# EAGLE design Triple_axis_digital_-_output_gyro_ITG-3200_Breakout (EAGLE 6.4)
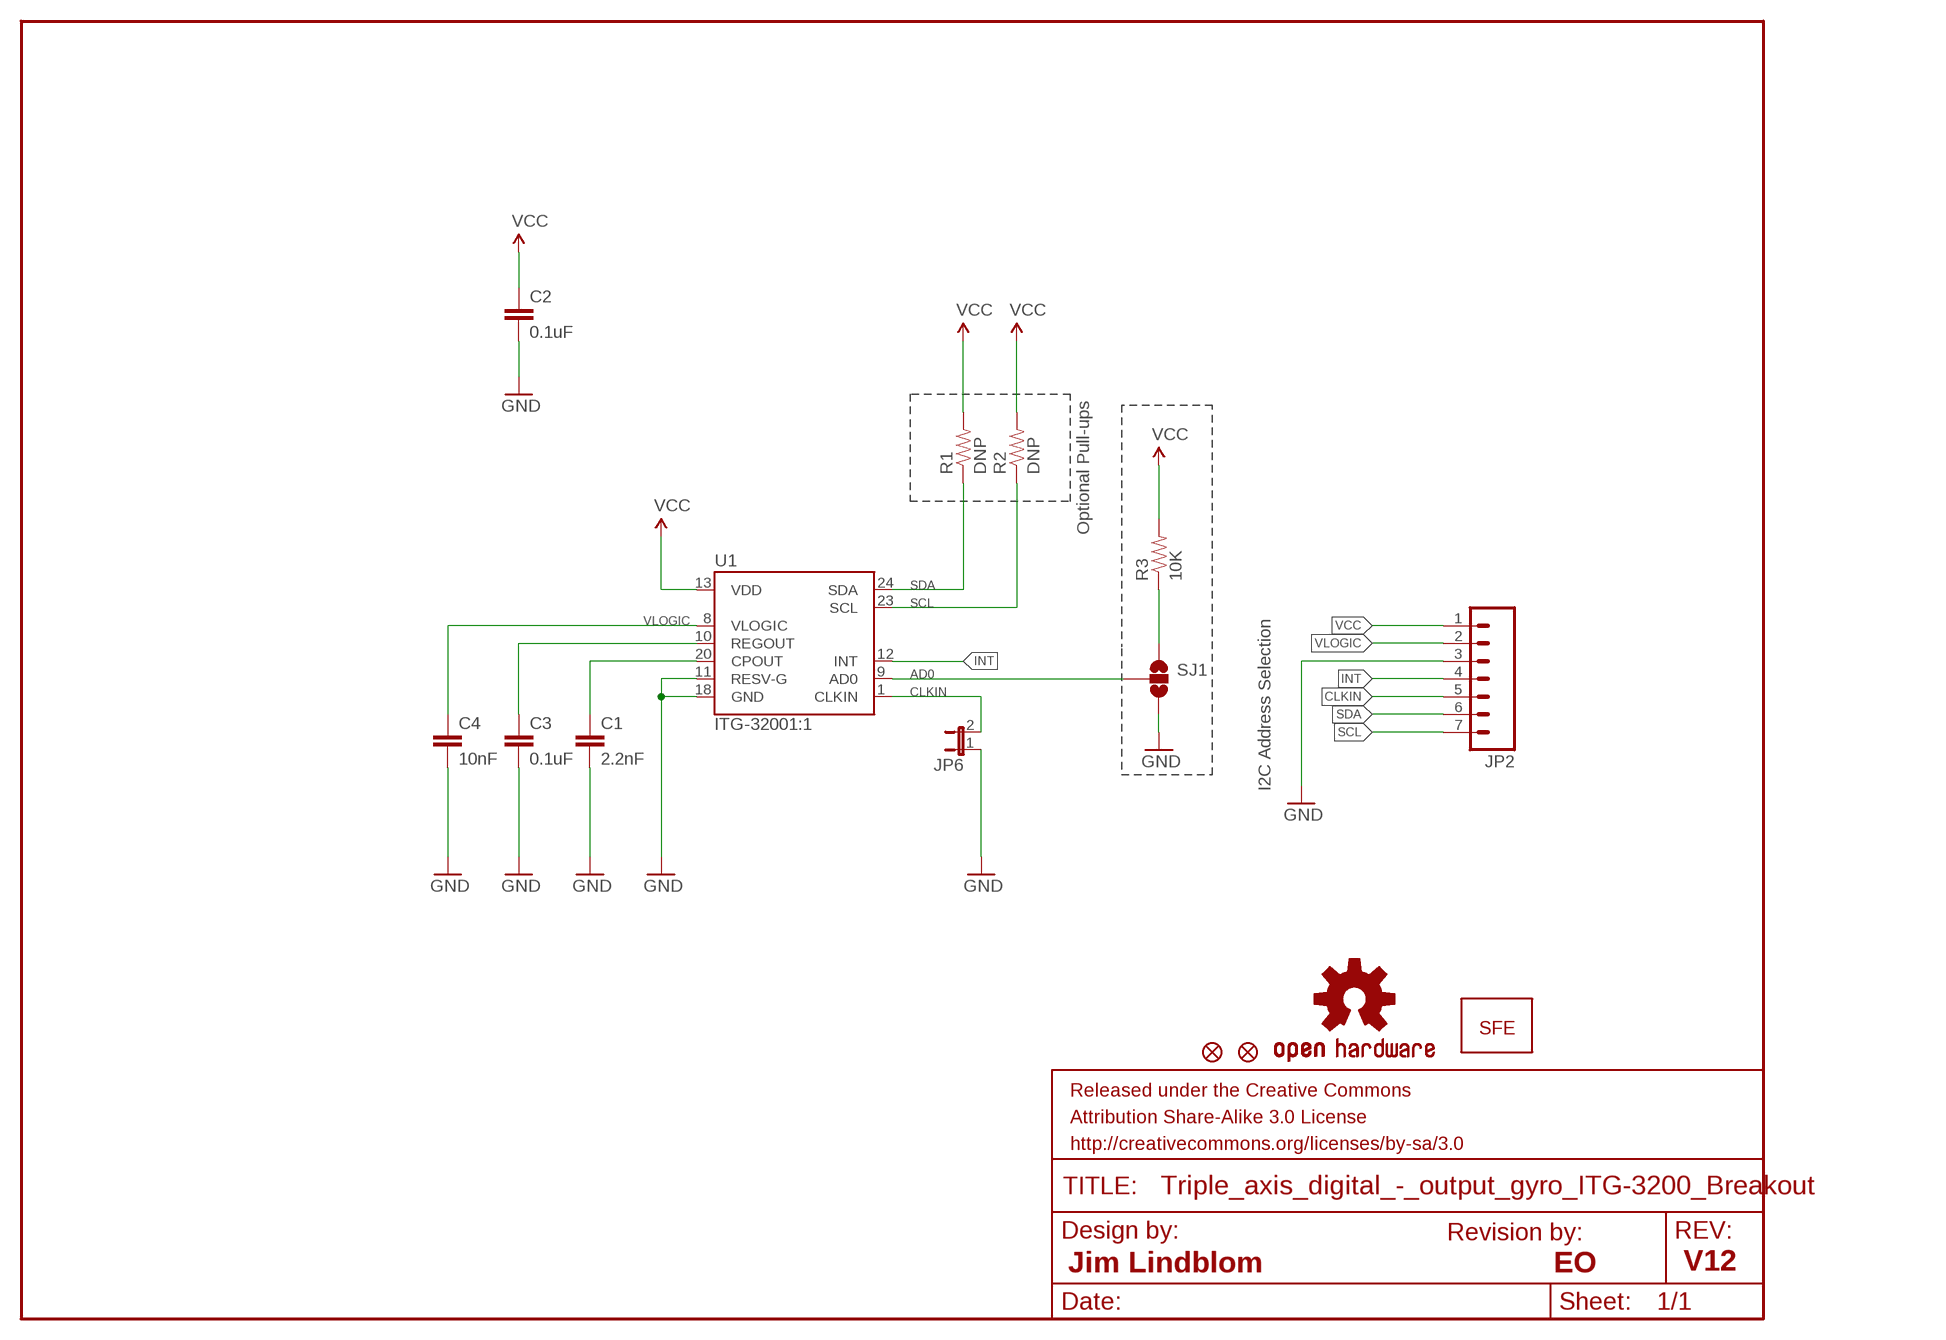
[diagram p0: schematic, sheet 1]

## Parts
C1  2.2nF  CAP0603-CAP  [0603-CAP]
C2  0.1uF  CAP0603-CAP  [0603-CAP]
C3  0.1uF  CAP0603-CAP  [0603-CAP]
C4  10nF  CAP0603-CAP  [0603-CAP]
FID1  FIDUCIALUFIDUCIAL  [MICRO-FIDUCIAL]
FID2  FIDUCIALUFIDUCIAL  [MICRO-FIDUCIAL]
FRAME1  FRAME-LETTER  [CREATIVE_COMMONS]
JP2  M07  [1X07]
JP6  JUMPER-2SMD-NO  [SJ_2S-NO]
LOGO1  OSHW-LOGOS  [OSHW-LOGO-S]
LOGO2  LOGO-SFESK  [SFE-LOGO-FLAME]
R1  DNP  RESISTOR0603-RES  [0603-RES]
R2  DNP  RESISTOR0603-RES  [0603-RES]
R3  10K  10KOHM1/10W1%(0603)0603  [0603-RES]
SJ1  SOLDERJUMPER_2WAYPASTE1&2  [SJ_3_PASTE1&2]
U1  ITG-32001:1  [QFN-24_ITG3200_1:1]

## Nets
AD0: SJ1.2 U1.9(AD0)
CLKIN: JP2.5 JP6.2 U1.1(CLKIN)
GND: C1.2 C2.2 C3.2 C4.2 JP2.3 JP6.1 SJ1.3 U1.11(RESV-G) U1.18(GND)
INT: JP2.4 U1.12(INT)
N$1: C1.1 U1.20(CPOUT)
N$2: C3.1 U1.10(REGOUT)
N$3: R3.1 SJ1.1
SCL: JP2.7 R2.1 U1.23(SCL)
SDA: JP2.6 R1.1 U1.24(SDA)
VCC: C2.1 JP2.1 R1.2 R2.2 R3.2 U1.13(VDD)
VLOGIC: C4.1 JP2.2 U1.8(VLOGIC)

## Notes on the sheet
- Optional Pull-ups
- I2C Address Selection
- Revision by:
- Jim Lindblom | EO | V12

## Library data of the parts
C1-C4 = SparkFun:CAP: Capacitor Standard 0603 ceramic capacitor, and 0.1" leaded capacitor.
FID1 FID2 = SparkFun-Aesthetics:FIDUCIAL: Fiducial Alignment Points Various fiducial points for machine vision alignment.
FRAME1 = SparkFun-Aesthetics:FRAME-LETTER: Schematic Frame Standard 8.5x11 US Letter frame
JP2 = SparkFun:M07: Header 7 Standard 7-pin 0.1" header. Use with straight break away headers (SKU : PRT-00116), right angle break away headers (PRT-00553), swiss pins (PRT-00743), machine pins (PRT-00117), and female headers (PRT-00115). NOTES ON THE VARIANTS LOCK and LOCK_LONGPADS... This footprint was designed to help hold the alignment of a through-hole component (i.e. 7-pin header) while soldering it into place. You may notice that each hole has been shifted either up or down by 0.005 of an inch from it's more standard position (which is usually a perfectly straight line). This slight alteration caused the pins (the squares in the middle) to touch the edges of the holes. Because they are alternating, it causes a "brace" to hold the header in place. 0.005 has proven to be the perfect amount of "off-center" position when using our standard breakaway headers. Although looks a little odd when you look at the bare footprint, once you have a header in there, the alteration is very hard to notice. Also, if you push a header all the way into place, it is covered up entirely on the bottom side. This idea of altering the position of holes to aid alignment will be further integrated into the Sparkfun Library for other footprints. It can help hold any component with 3 or more connection pins.
JP6 = SparkFun:JUMPER-2: Jumper Basic 0.1" spaced jumper. Use with breakaway headers.
LOGO1 = SparkFun-Aesthetics:OSHW-LOGO: Open Source Hardware Logo This logo indicates the piece of hardware it is found on incorporates a OSHW license and/or adheres to the definition of open source hardware found here: http://freedomdefined.org/OSHW
LOGO2 = SparkFun-Aesthetics:LOGO-SFE: Spark Fun Electronics PCB Logo This is the standard Spark Fun Electronics PCB logo.
R1 R2 = SparkFun:RESISTOR: Resistor Basic schematic elements and footprints for 0603, 1206, and PTH resistors.
R3 = SparkFun-Resistors:10KOHM1/10W1%(0603): RES-00824; PROD_ID: RES-00824
SJ1 = SparkFun:SOLDERJUMPER_2WAY: Solder Jumper 2 way solder jumper
U1 = SparkFun-DigitalIC:ITG-3200: ITG-3200 3-axis gyro, digital output, qfn24 package

## Board
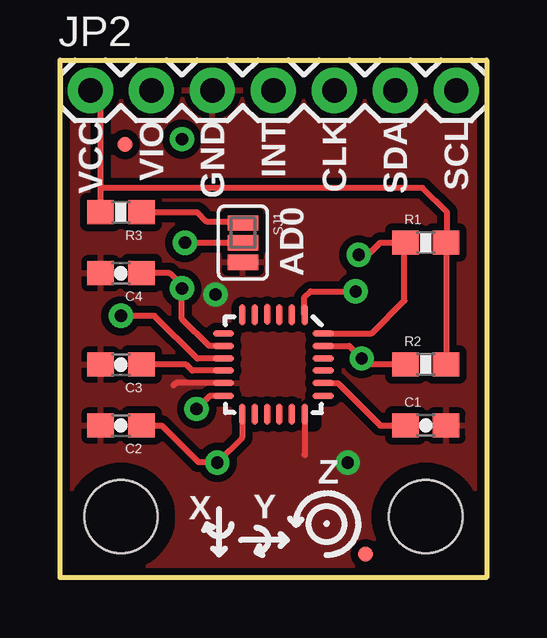
[diagram p1: board, top side]
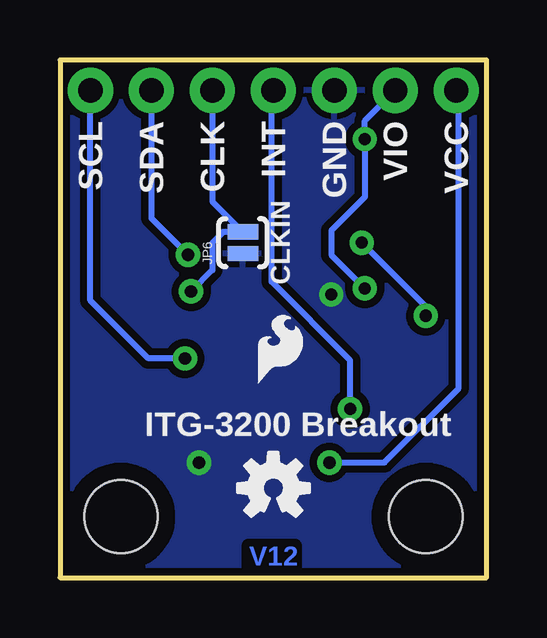
[diagram p2: board, bottom side, seen from below]

Size 17.78 x 21.59 mm. Coordinates in mm from the lower left corner, seen from the top.
Outline: 0,0 0,21.59 17.78,21.59 17.78,0 0,0
Copper layers (1*16): Top 0.035mm / dielectric 1.5mm / Bottom 0.035mm
Design rules "SparkFun": minimum track width 7mil, minimum drill 15mil, track to track 8mil, track to pad 8mil, pad to pad 8mil, via to via 8mil, smd to smd 8mil, copper to edge 8mil, drill to drill 8mil, minimum pad ring 12mil, minimum via ring 10mil, stop-mask expansion 4mil, vias tented up to drill 20mil, thermal gap 10mil
tRestrict: area 10.3,-1.2 to 10.6,-0.4; area 10.3,6.4 to 10.6,7.2

### Footprints (pad centres in the part's own frame; a part is rotated, then mirrored left to right if it is on the bottom)
0603-CAP = smd 1.1 x 1: 1 -0.85,0; 2 0.85,0
MICRO-FIDUCIAL = smd 0.635 x 0.635: 1 0,0
1X07 = drill 1.016 pad 1.88: 1 0,0; 2 2.54,0; 3 5.08,0; 4 7.62,0; 5 10.16,0; 6 12.7,0; 7 15.24,0
SJ_2S-NO = smd 0.635 x 1.27: 1 -0.45,0; 2 0.45,0
0603-RES = smd 1.1 x 1: 1 -0.85,0; 2 0.85,0
SJ_3_PASTE1&2 = smd 0.635 x 1.27: 1 -0.813,0; 2 0,0; 3 0.813,0
QFN-24_ITG3200_1:1 = smd 0.889 x 0.279: 1 -2.076,1.301; 2 -2.076,0.775; 3 -2.076,0.25; 4 -2.102,-0.25; 5 -2.076,-0.775; 6 -2.076,-1.301; 13 2.076,-1.301; 14 2.076,-0.775; 15 2.076,-0.25; 16 2.076,0.25; 17 2.076,0.775; 18 2.076,1.301 | smd 0.279 x 0.889: 7 -1.301,-2.076; 8 -0.775,-2.076; 9 -0.25,-2.076; 10 0.25,-2.076; 11 0.775,-2.076; 12 1.301,-2.076; 19 1.301,2.076; 20 0.775,2.076; 21 0.25,2.076; 22 -0.25,2.076; 23 -0.775,2.076; 24 -1.301,2.076
STAND-OFF-TIGHT = hole 3.048: 0,0

### Placement (x,y rotation side)
C1  15.24,6.35 0 top
C2  2.54,6.35 180 top
C3  2.54,8.89 180 top
C4  2.54,12.7 180 top
FID1  2.72,18.06 0 top
FID2  12.73,0.99 0 top
FRAME1  -27.94,-15.24 0 top  (outside the outline)
JP2  1.27,20.32 0 top
JP6  10.16,13.97 90 bottom
LOGO1  8.89,3.73 0 bottom
LOGO2  9.53,8.13 0 bottom
R1  15.24,13.97 0 top
R2  15.24,8.89 0 top
R3  2.54,15.24 180 top
SJ1  7.62,13.97 270 top
U1  8.89,8.89 270 top
U$1  [STAND-OFF-TIGHT]  15.24,2.54 0 top
U$2  [STAND-OFF-TIGHT]  2.54,2.54 0 top

### Tracks (layer width: path | path; a pad name or v marks a point on that pad's centre or on a via)
AD0  (via drill 0.51)
  Top 0.254: U1.9 5.72,9.14 3.94,10.92 v2.54,10.92 | v5.21,13.97 SJ1.2
  Bottom 0.254: v2.54,10.92 2.54,11.3 v5.21,13.97
CLKIN  (via drill 0.51)
  Top 0.254: U1.1 10.19,11.68 10.44,11.94 v12.32,11.94
  Bottom 0.254: JP2.5 11.43,15.69 JP6.2 10.98,14.42 11.43,13.97 11.43,12.83 v12.32,11.94
GND  (via drill 0.51)
  Top 0.254: U1.18 10.19,5.12 10.21,5.11 | U1.11 4.81,8.12 4.72,8.03
  other vias: 11.99,4.8 6.48,11.81
  pour Top (isolate 0.305): 0,0 0,21.59 17.78,21.59 17.78,0
  pour Bottom (isolate 0.305): 0,0 0,21.59 17.78,21.59 17.78,0
INT  (via drill 0.51)
  Top 0.254: U1.12 6.24,7.59 v5.69,7.04
  Bottom 0.254: v5.69,7.04 5.69,9.07 8.97,12.34 8.97,20.24 JP2.4
N$1
  Top 0.254: U1.20 11.57,8.12 13.34,6.35 C1.1
N$2
  Top 0.254: U1.10 5.51,8.64 5.26,8.89 C3.1
N$3
  Top 0.254: R3.1 5.71,15.24 6.1,14.86 7.54,14.86 SJ1.1
SCL  (via drill 0.51)
  Top 0.254: U1.23 12.05,9.66 v12.57,9.14 12.83,8.89 R2.1
  Bottom 0.254: v12.57,9.14 14.1,9.14 16.51,11.56 JP2.7
SDA  (via drill 0.51)
  Top 0.254: U1.24 12.98,10.19 14.35,11.56 14.35,13.93 R1.1 13.34,13.97 12.83,13.46 v12.45,13.46
  Bottom 0.254: JP2.6 13.97,14.99 v12.45,13.46
VCC  (via drill 0.51)
  Top 0.254: R2.2 R1.2 16.13,14.01 16.13,15.24 15.11,16.26 1.69,16.26 | 1.65,15.28 R3.2 1.69,16.26 | 1.69,16.26 1.69,19.9 JP2.1 | U1.13 7.59,5.84 v6.55,4.8 6.53,4.83 5.77,4.83 4.24,6.35 C2.1
  Bottom 0.254: JP2.1 1.17,20.22 1.17,7.9 4.27,4.8 v6.55,4.8
VLOGIC  (via drill 0.51)
  Top 0.254: C4.1 4.57,12.7 5.08,12.19 v5.08,12.06 5.08,10.79 6.21,9.66 U1.8
  Bottom 0.254: JP2.2 5.08,19.05 v5.08,18.29 5.08,15.88 6.48,14.48 6.48,13.46 v5.08,12.06

### Text on the board
Bottom: V12
tPlace: VCC | VIO | GND | INT | CLK | SDA | SCL | AD0 | Z | X | Y
bPlace: VCC | VIO | GND | INT | CLK | SDA | SCL | CLKIN | ITG-3200 Breakout